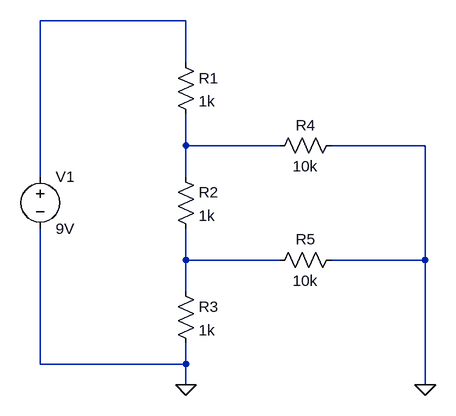
[diagram p0: schematic Schema2.asc]
Schema2.asc, the LTspice schematic file:
Version 4
SHEET 1 880 680
WIRE 208 -160 -16 -160
WIRE 208 -96 208 -160
WIRE 208 32 208 -16
WIRE 352 32 208 32
WIRE 576 32 432 32
WIRE -16 80 -16 -160
WIRE 208 80 208 32
WIRE 208 208 208 160
WIRE 352 208 208 208
WIRE 576 208 576 32
WIRE 576 208 432 208
WIRE 208 256 208 208
WIRE -16 368 -16 160
WIRE 208 368 208 336
WIRE 208 368 -16 368
WIRE 208 400 208 368
WIRE 576 400 576 208
FLAG 208 400 0
FLAG 576 400 0
SYMBOL voltage -16 64 R0
WINDOW 123 0 0 Left 0
WINDOW 39 0 0 Left 0
SYMATTR InstName V1
SYMATTR Value 9V
SYMBOL res 192 64 R0
SYMATTR InstName R2
SYMATTR Value 1k
SYMBOL res 192 -112 R0
SYMATTR InstName R1
SYMATTR Value 1k
SYMBOL res 192 240 R0
SYMATTR InstName R3
SYMATTR Value 1k
SYMBOL res 448 16 R90
WINDOW 0 0 56 VBottom 2
WINDOW 3 32 56 VTop 2
SYMATTR InstName R4
SYMATTR Value 10k
SYMBOL res 448 192 R90
WINDOW 0 0 56 VBottom 2
WINDOW 3 32 56 VTop 2
SYMATTR InstName R5
SYMATTR Value 10k

The netlist it stands for:
* Schema2.asc
V1 N001 0 9V
R2 N002 N003 1k
R1 N001 N002 1k
R3 N003 0 1k
R4 0 N002 10k
R5 0 N003 10k
.backanno
.end